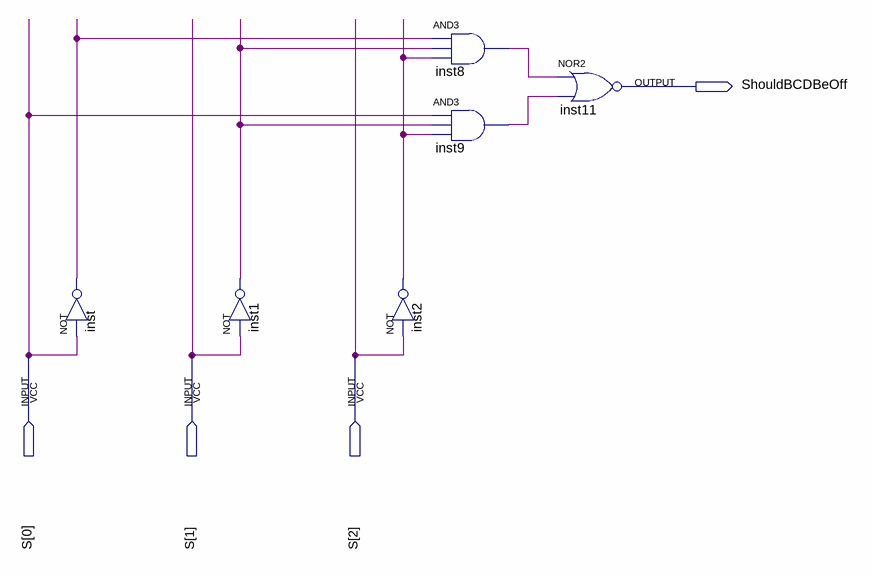
[diagram p0: schematic sheet]
// Quartus schematic ShouldBCDBeOff.bdf as structural Verilog: 6 symbols, 4 pins
module ShouldBCDBeOff (
  input  [2:0] S,
  output ShouldBCDBeOff
);

  wire inst1_out, inst2_out, inst8_out, inst9_out, inst_out;

  not inst (inst_out, S[0]);
  not inst1 (inst1_out, S[1]);
  not inst2 (inst2_out, S[2]);
  and inst8 (inst8_out, inst_out, inst1_out, inst2_out);
  and inst9 (inst9_out, S[0], inst1_out, inst2_out);
  nor inst11 (ShouldBCDBeOff, inst8_out, inst9_out);
endmodule
